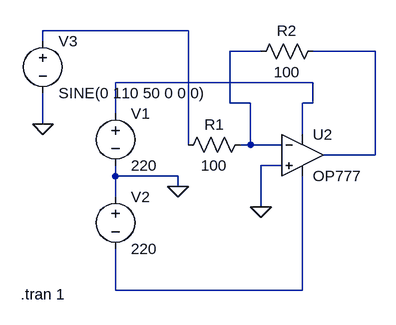
[diagram p0: schematic opam.asc]
opam.asc, the LTspice schematic file:
Version 4
SHEET 1 880 680
WIRE -208 16 -432 16
WIRE -432 32 -432 16
WIRE -96 48 -144 48
WIRE 80 48 -16 48
WIRE -16 96 -320 96
WIRE -144 128 -144 48
WIRE -112 128 -144 128
WIRE -16 128 -16 96
WIRE -16 128 -32 128
WIRE -320 144 -320 96
WIRE -432 160 -432 112
WIRE -32 176 -32 128
WIRE -208 192 -208 16
WIRE -112 192 -112 128
WIRE -112 192 -128 192
WIRE -64 192 -112 192
WIRE 80 208 80 48
WIRE 80 208 0 208
WIRE -64 224 -96 224
WIRE -320 240 -320 224
WIRE -224 240 -320 240
WIRE -224 256 -224 240
WIRE -320 272 -320 240
WIRE -96 288 -96 224
WIRE -320 416 -320 352
WIRE -32 416 -32 240
WIRE -32 416 -320 416
FLAG -224 256 0
FLAG -96 288 0
FLAG -432 160 0
SYMBOL voltage -320 128 R0
WINDOW 123 0 0 Left 0
WINDOW 39 0 0 Left 0
SYMATTR InstName V1
SYMATTR Value 220
SYMBOL voltage -320 256 R0
WINDOW 123 0 0 Left 0
WINDOW 39 0 0 Left 0
SYMATTR InstName V2
SYMATTR Value 220
SYMBOL res -112 176 R90
WINDOW 0 0 56 VBottom 2
WINDOW 3 32 56 VTop 2
SYMATTR InstName R1
SYMATTR Value 100
SYMBOL voltage -432 16 R0
WINDOW 123 0 0 Left 0
WINDOW 39 0 0 Left 0
SYMATTR InstName V3
SYMATTR Value SINE(0 110 50 0 0 0)
SYMBOL res 0 32 R90
WINDOW 0 0 56 VBottom 2
WINDOW 3 32 56 VTop 2
SYMATTR InstName R2
SYMATTR Value 100
SYMBOL OpAmps\\OP777 -32 144 R0
SYMATTR InstName U2
TEXT -466 422 Left 2 !.tran 1

The netlist it stands for:
* opam.asc
V1 N004 0 220
V2 0 N005 220
R1 N002 N001 100
V3 N001 0 SINE(0 110 50 0 0 0)
R2 N003 N002 100
XU2 0 N002 N004 N005 N003 OP777  ; pins In+ In- V+ V- OUT
.tran 1
.lib ADI.lib
.backanno
.end